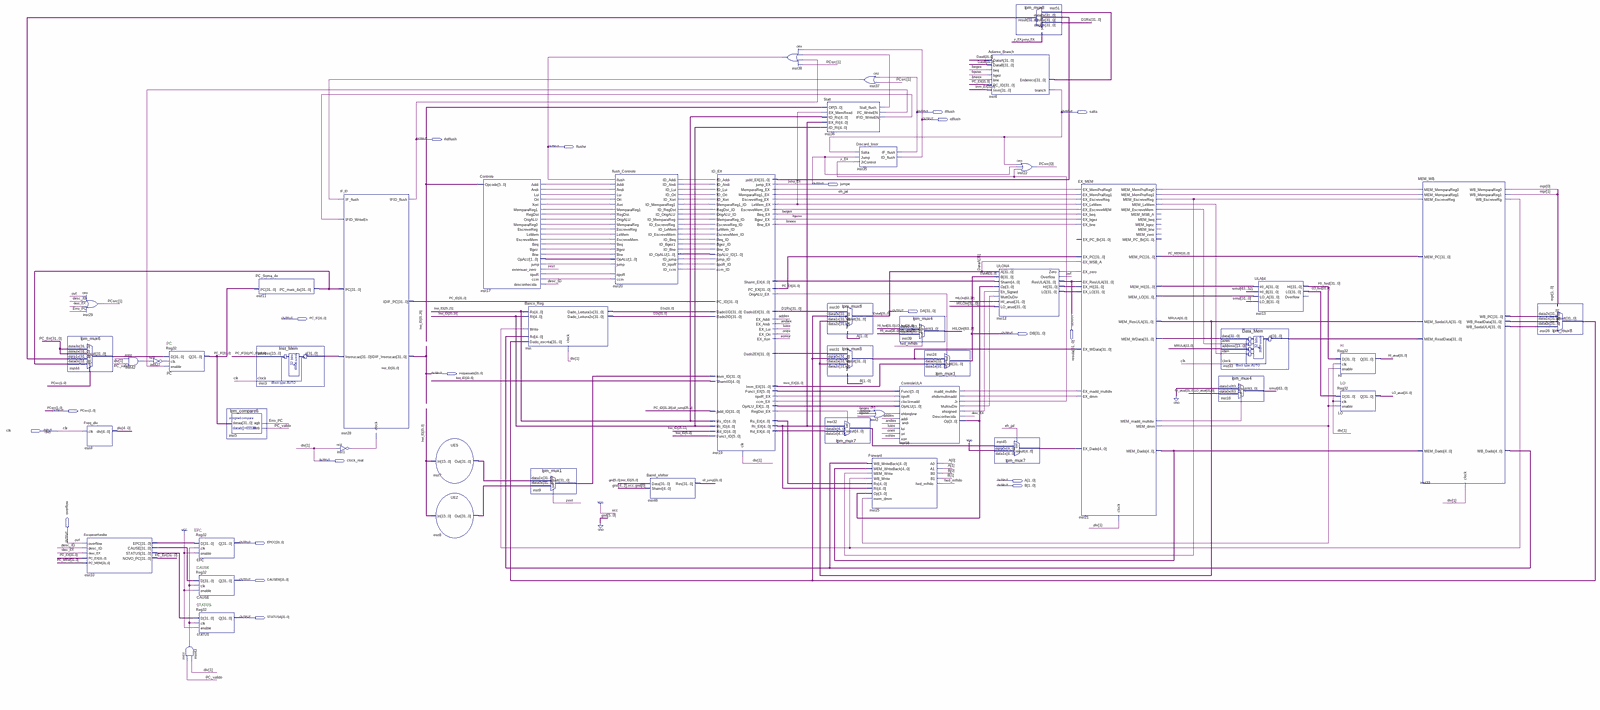
[diagram p0: schematic sheet, whole]
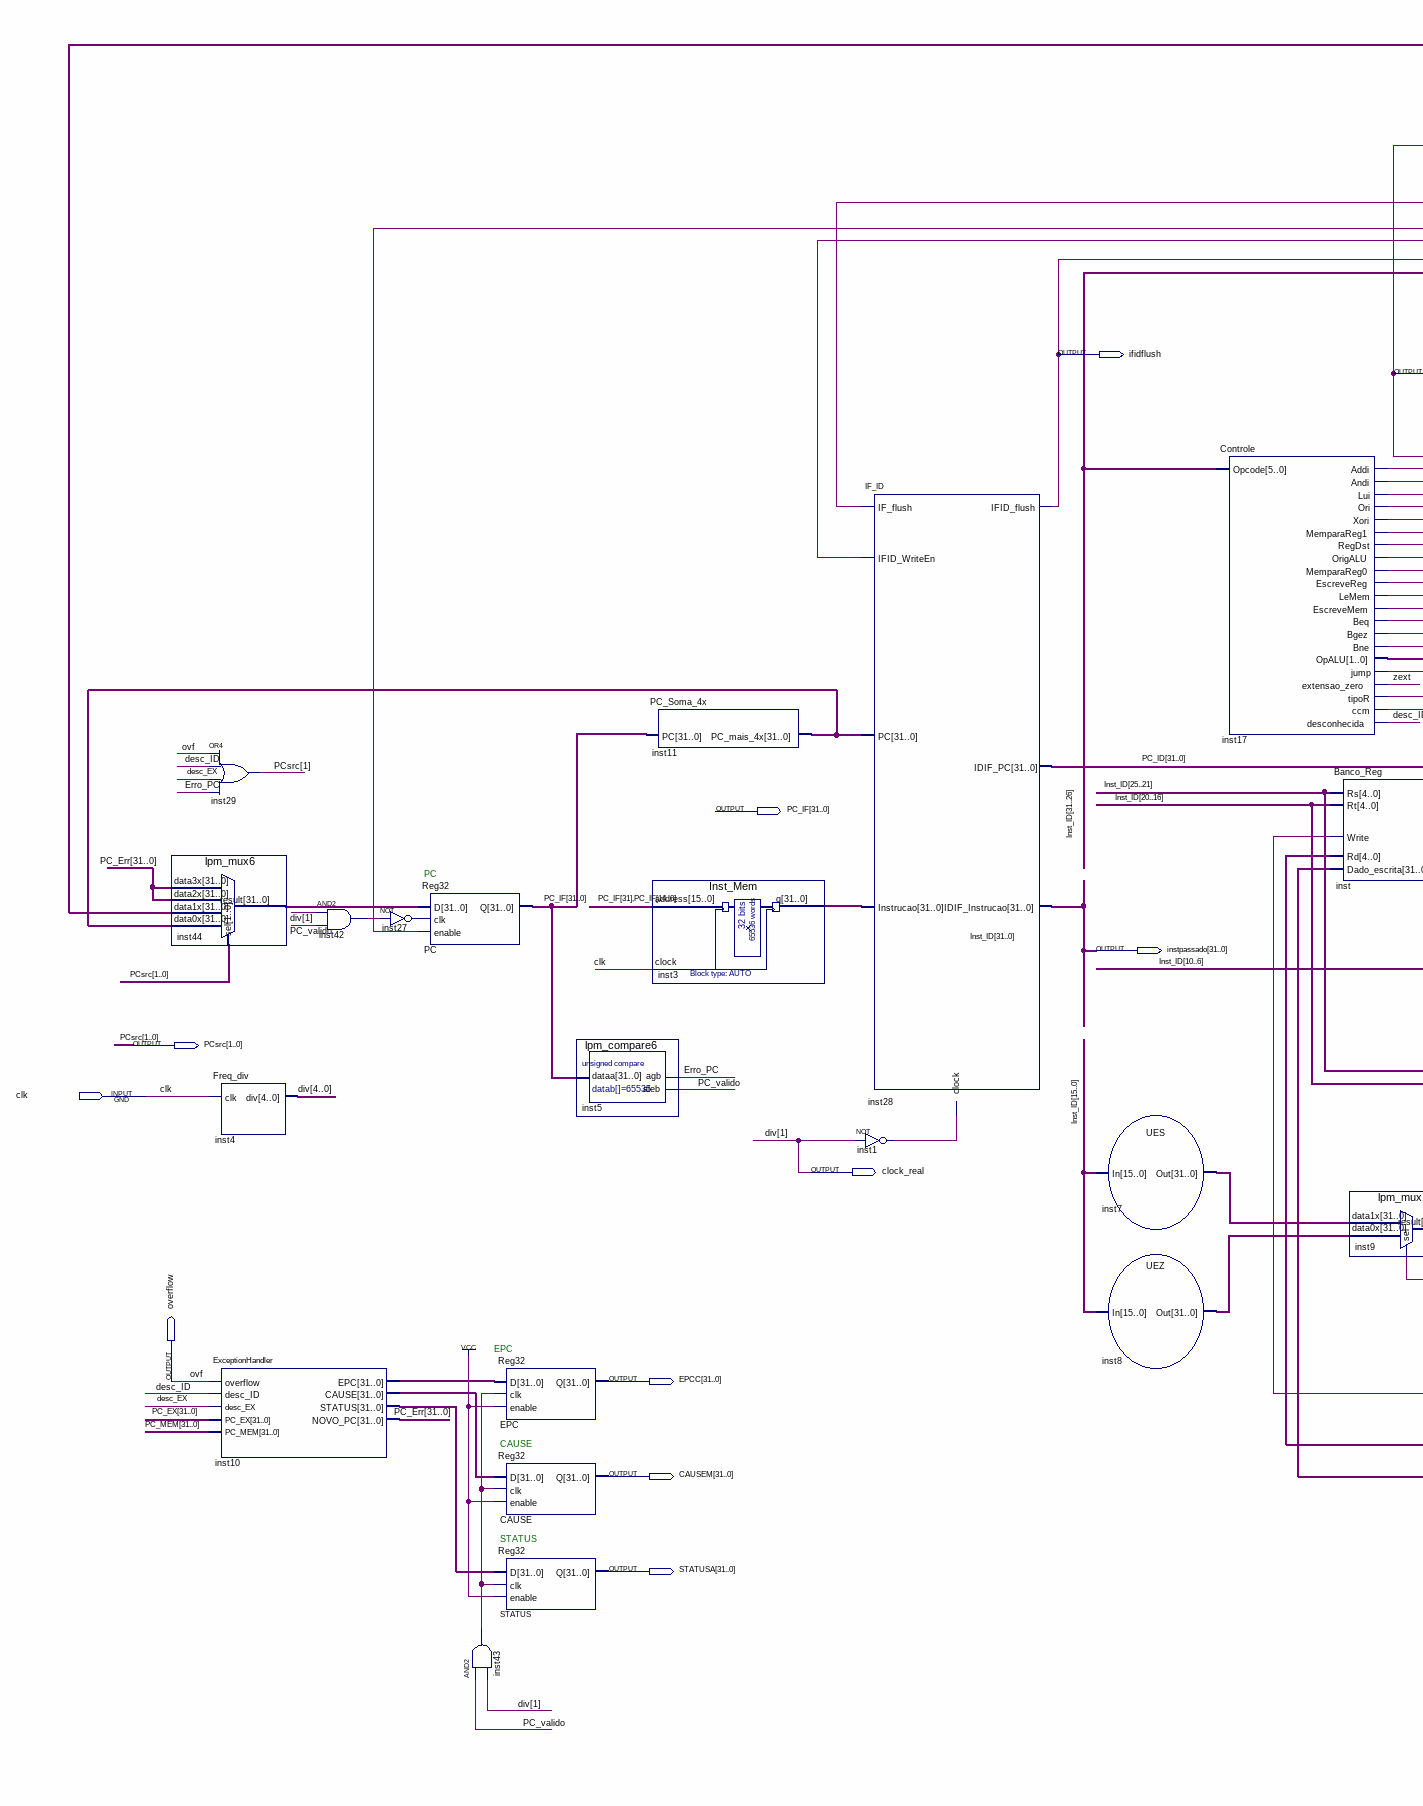
[diagram p1: schematic sheet, left part]
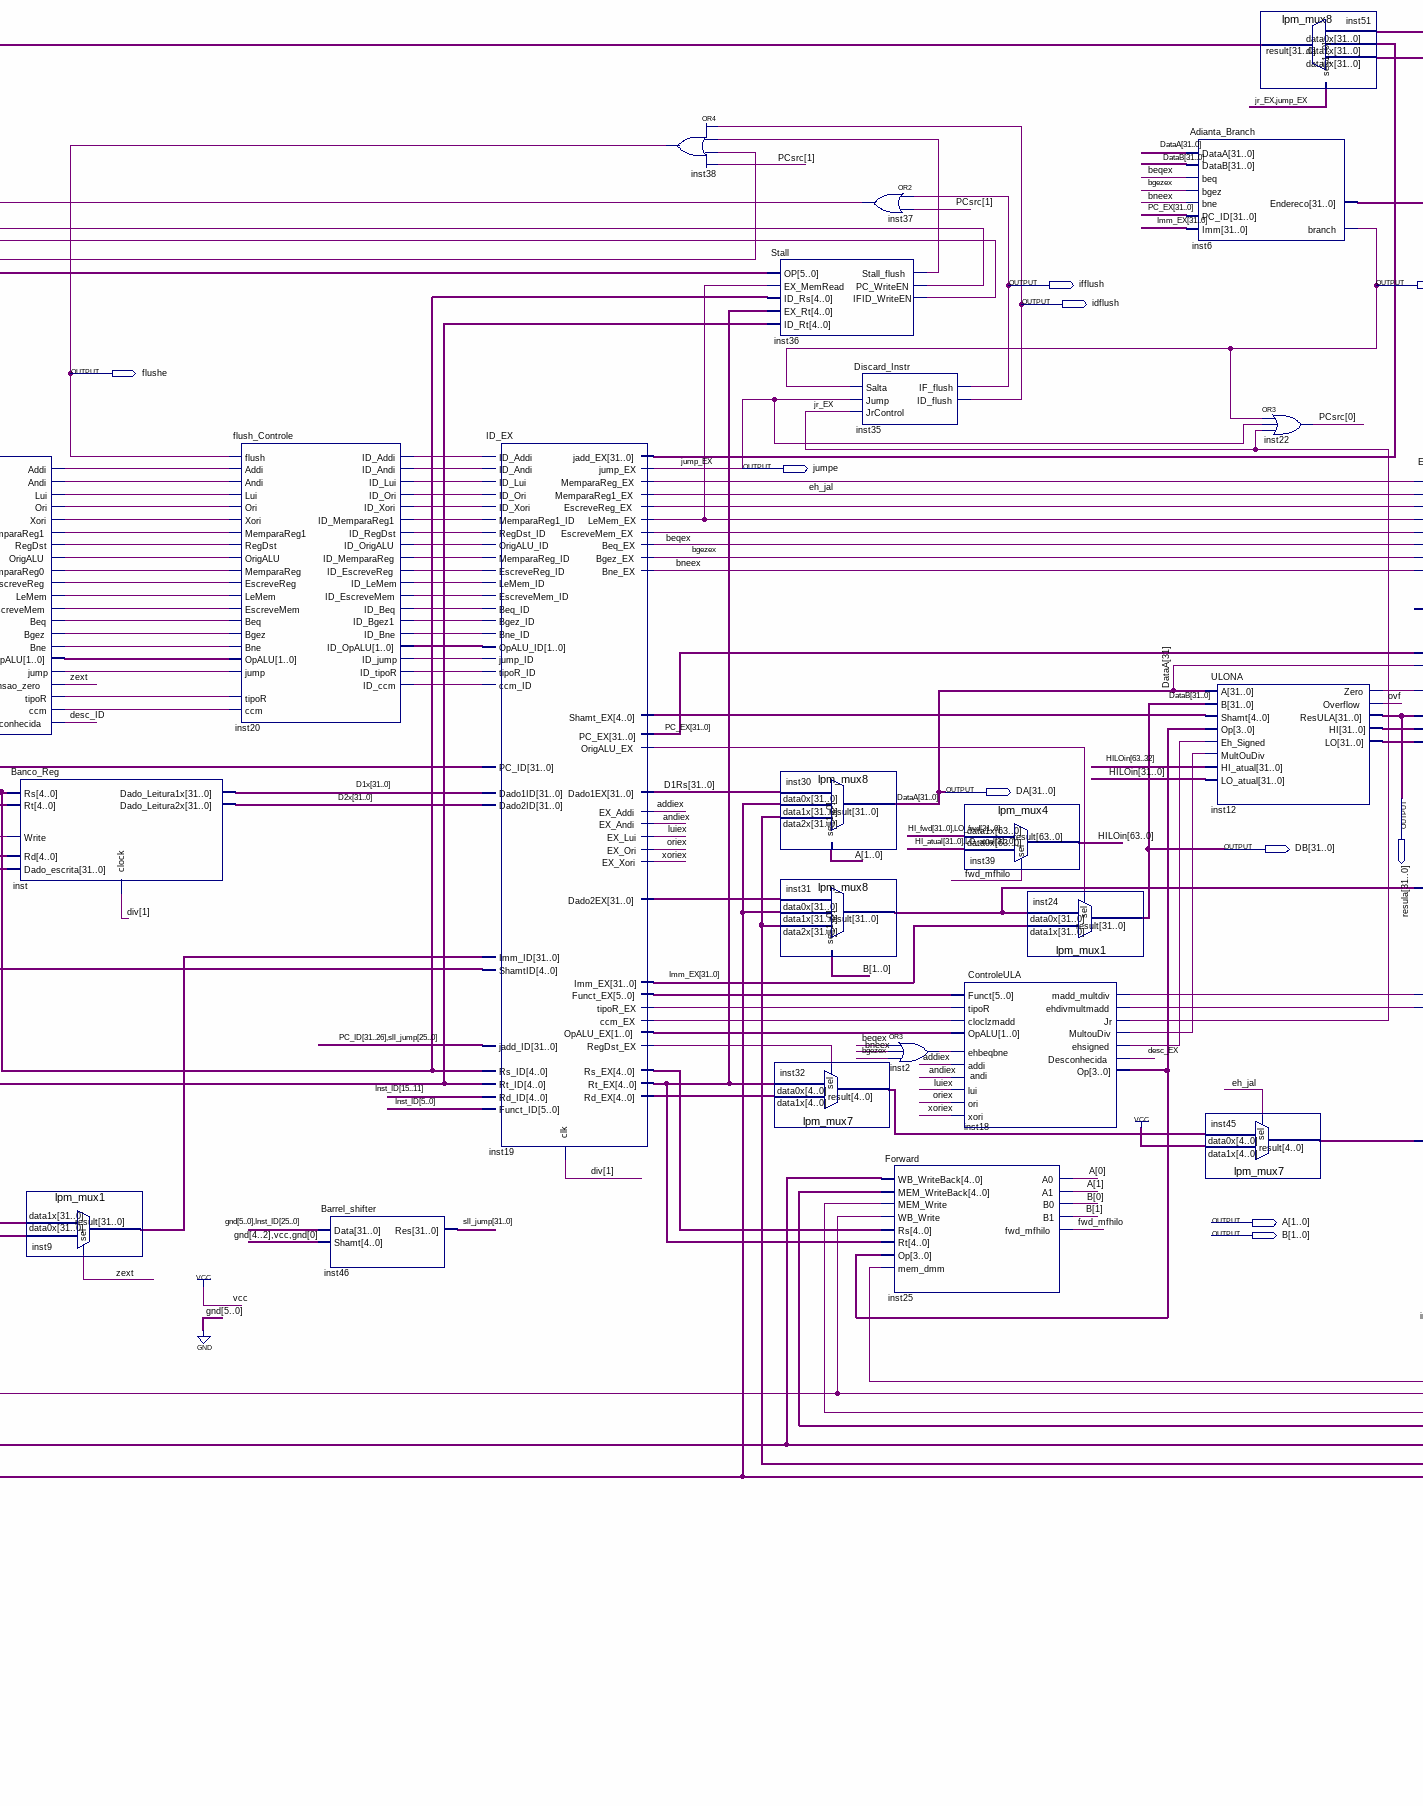
[diagram p2: schematic sheet, centre part]
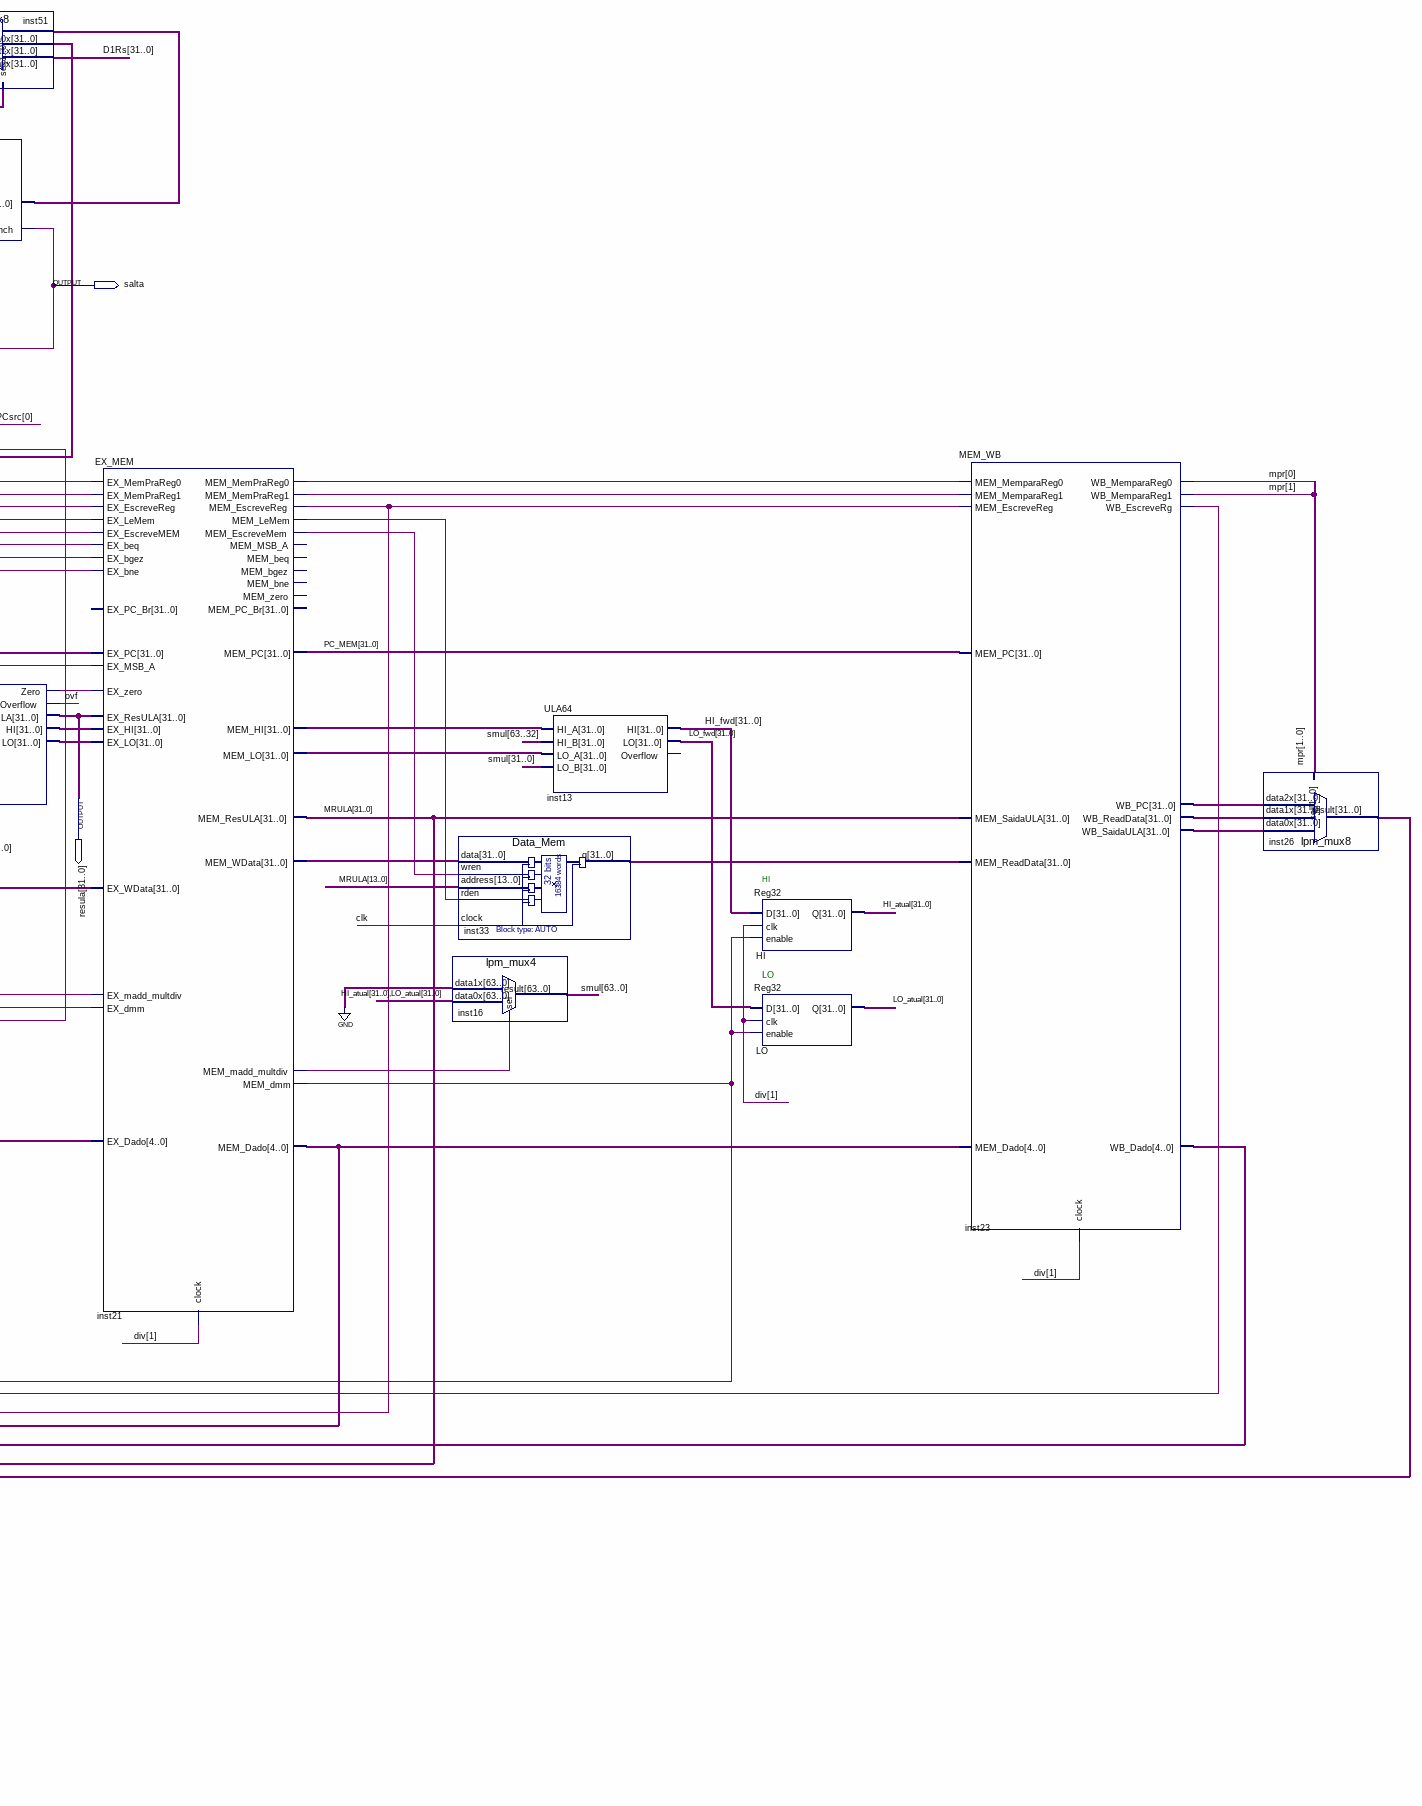
[diagram p3: schematic sheet, right part]
// Quartus schematic Pipeline.bdf as structural Verilog: 49 symbols, 20 pins
module Pipeline (
  input  clk,
  output ifflush,
  output salta,
  output idflush,
  output ifidflush,
  output flushe,
  output jumpe,
  output [31:0] DA,
  output [31:0] resula,
  output [31:0] PC_IF,
  output [31:0] DB,
  output [31:0] instpassado,
  output [1:0] PCsrc,
  output clock_real,
  output [1:0] A,
  output [1:0] B,
  output overflow,
  output [31:0] EPCC,
  output [31:0] CAUSEM,
  output [31:0] STATUSA
);

  wire addiex, andiex, beqex, bgezex, bneex, desc_EX, desc_ID, eh_jal, Erro_PC, fwd_mfhilo, inst1_out,
       inst2_out, inst12_zero, inst17_addi, inst17_andi, inst17_beq, inst17_bgez, inst17_bne, inst17_ccm,
       inst17_escrevemem, inst17_escrevereg, inst17_jump, inst17_lemem, inst17_lui, inst17_memparareg0,
       inst17_memparareg1, inst17_ori, inst17_origalu, inst17_regdst, inst17_tipor, inst17_xori,
       inst18_ehdivmultmadd, inst18_ehsigned, inst18_madd_multdiv, inst18_multoudiv, inst19_ccm_ex,
       inst19_escrevemem_ex, inst19_escrevereg_ex, inst19_lemem_ex, inst19_memparareg_ex, inst19_origalu_ex,
       inst19_regdst_ex, inst19_tipor_ex, inst20_id_addi, inst20_id_andi, inst20_id_beq, inst20_id_bgez1,
       inst20_id_bne, inst20_id_ccm, inst20_id_escrevemem, inst20_id_escrevereg, inst20_id_jump,
       inst20_id_lemem, inst20_id_lui, inst20_id_memparareg, inst20_id_memparareg1, inst20_id_ori,
       inst20_id_origalu, inst20_id_regdst, inst20_id_tipor, inst20_id_xori, inst21_mem_dmm,
       inst21_mem_escrevemem, inst21_mem_escrevereg, inst21_mem_lemem, inst21_mem_madd_multdiv,
       inst21_mem_memprareg0, inst21_mem_memprareg1, inst23_wb_escreverg, inst27_out, inst36_ifid_writeen,
       inst36_pc_writeen, inst36_stall_flush, inst37_out, inst42_out, inst43_out, jr_EX, luiex, oriex,
       PC_valido, xoriex, zext;
  wire [1:0] inst17_opalu, inst19_opalu_ex, inst20_id_opalu, mpr;
  wire [3:0] inst18_op;
  wire [4:0] div, inst19_rd_ex, inst19_rs_ex, inst19_rt_ex, inst19_shamt_ex, inst21_mem_dado, inst23_wb_dado,
       inst32_result, inst45_result;
  wire [5:0] inst19_funct_ex;
  wire [31:0] D1Rs, D1x, D2x, HI_atual, HI_fwd, Imm_EX, inst3_q, inst6_endereco, inst7_out, inst8_out,
       inst9_result, inst10_cause, inst10_epc, inst10_status, inst11_pc_mais_4x, inst12_hi, inst12_lo,
       inst19_dado2ex, inst19_jadd_ex, inst21_mem_hi, inst21_mem_lo, inst21_mem_wdata, inst23_wb_pc,
       inst23_wb_readdata, inst23_wb_saidaula, inst26_result, inst31_result, inst33_q, inst44_result,
       inst51_result, LO_atual, LO_fwd, MRULA, PC_Err, PC_EX, PC_ID, PC_MEM, sll_jump;
  wire [63:0] HILOin, smul;

  lpm_mux6 inst44 (
    .data3x(PC_Err), .data2x(PC_Err), .data1x(inst51_result), .data0x(inst11_pc_mais_4x), .sel(PCsrc),
    .result(inst44_result));
  or inst29 (PCsrc[1], overflow, desc_ID, desc_EX, Erro_PC);
  Freq_div inst4 (.clk(clk), .div({div[4:2], clock_real, div[0]}));
  ExceptionHandler inst10 (
    .overflow(overflow), .desc_ID(desc_ID), .desc_EX(desc_EX), .PC_EX(PC_EX), .PC_MEM(PC_MEM),
    .EPC(inst10_epc), .CAUSE(inst10_cause), .STATUS(inst10_status), .NOVO_PC(PC_Err));
  and inst42 (inst42_out, clock_real, PC_valido);
  not inst27 (inst27_out, inst42_out);
  Reg32 PC (.D(inst44_result), .clk(inst27_out), .enable(inst36_pc_writeen), .Q(PC_IF));
  and inst43 (inst43_out, PC_valido, clock_real);
  Reg32 EPC (.D(inst10_epc), .clk(inst43_out), .enable(1'b1), .Q(EPCC));
  Reg32 CAUSE (.D(inst10_cause), .clk(inst43_out), .enable(1'b1), .Q(CAUSEM));
  Reg32 STATUS (.D(inst10_status), .clk(inst43_out), .enable(1'b1), .Q(STATUSA));
  lpm_compare6 inst5 (.dataa(PC_IF), .agb(Erro_PC), .aleb(PC_valido));
  PC_Soma_4x inst11 (.PC(PC_IF), .PC_mais_4x(inst11_pc_mais_4x));
  Inst_Mem inst3 (.address({PC_IF[31], PC_IF[14:0]}), .clock(clk), .q(inst3_q));
  IF_ID inst28 (
    .IF_flush(inst37_out), .PC(inst11_pc_mais_4x), .clock(inst1_out), .Instrucao(inst3_q),
    .IFID_WriteEn(inst36_ifid_writeen), .IFID_flush(ifidflush), .IDIF_PC(PC_ID), .IDIF_Instrucao(instpassado));
  not inst1 (inst1_out, clock_real);
  UES inst7 (.In(instpassado[15:0]), .Out(inst7_out));
  UEZ inst8 (.In(instpassado[15:0]), .Out(inst8_out));
  Controle inst17 (
    .Opcode(instpassado[31:26]), .Addi(inst17_addi), .Andi(inst17_andi), .Lui(inst17_lui), .Ori(inst17_ori),
    .Xori(inst17_xori), .MemparaReg1(inst17_memparareg1), .RegDst(inst17_regdst), .OrigALU(inst17_origalu),
    .MemparaReg0(inst17_memparareg0), .EscreveReg(inst17_escrevereg), .LeMem(inst17_lemem),
    .EscreveMem(inst17_escrevemem), .Beq(inst17_beq), .Bgez(inst17_bgez), .Bne(inst17_bne),
    .OpALU(inst17_opalu), .jump(inst17_jump), .extensao_zero(zext), .tipoR(inst17_tipor), .ccm(inst17_ccm),
    .desconhecida(desc_ID));
  Banco_Reg inst (
    .Rs(instpassado[25:21]), .Rt(instpassado[20:16]), .Dado_escrita(inst26_result), .clock(clock_real),
    .Write(inst23_wb_escreverg), .Rd(inst23_wb_dado), .Dado_Leitura1x(D1x), .Dado_Leitura2x(D2x));
  lpm_mux1 inst9 (.data1x(inst7_out), .data0x(inst8_out), .sel(zext), .result(inst9_result));
  flush_Controle inst20 (
    .flush(flushe), .Addi(inst17_addi), .Andi(inst17_andi), .Lui(inst17_lui), .Ori(inst17_ori),
    .Xori(inst17_xori), .MemparaReg1(inst17_memparareg1), .RegDst(inst17_regdst), .OrigALU(inst17_origalu),
    .MemparaReg(inst17_memparareg0), .EscreveReg(inst17_escrevereg), .LeMem(inst17_lemem),
    .EscreveMem(inst17_escrevemem), .Beq(inst17_beq), .Bgez(inst17_bgez), .Bne(inst17_bne),
    .OpALU(inst17_opalu), .jump(inst17_jump), .tipoR(inst17_tipor), .ccm(inst17_ccm),
    .ID_Addi(inst20_id_addi), .ID_Andi(inst20_id_andi), .ID_Lui(inst20_id_lui), .ID_Ori(inst20_id_ori),
    .ID_Xori(inst20_id_xori), .ID_MemparaReg1(inst20_id_memparareg1), .ID_RegDst(inst20_id_regdst),
    .ID_OrigALU(inst20_id_origalu), .ID_MemparaReg(inst20_id_memparareg),
    .ID_EscreveReg(inst20_id_escrevereg), .ID_LeMem(inst20_id_lemem), .ID_EscreveMem(inst20_id_escrevemem),
    .ID_Beq(inst20_id_beq), .ID_Bgez1(inst20_id_bgez1), .ID_Bne(inst20_id_bne), .ID_OpALU(inst20_id_opalu),
    .ID_jump(inst20_id_jump), .ID_tipoR(inst20_id_tipor), .ID_ccm(inst20_id_ccm));
  Barrel_shifter inst46 (.Data({{6{1'b0}}, instpassado[25:0]}), .Shamt(5'b00010), .Res(sll_jump));
  ID_EX inst19 (
    .ID_Addi(inst20_id_addi), .ID_Andi(inst20_id_andi), .ID_Lui(inst20_id_lui), .ID_Ori(inst20_id_ori),
    .ID_Xori(inst20_id_xori), .MemparaReg1_ID(inst20_id_memparareg1), .RegDst_ID(inst20_id_regdst),
    .OrigALU_ID(inst20_id_origalu), .MemparaReg_ID(inst20_id_memparareg),
    .EscreveReg_ID(inst20_id_escrevereg), .LeMem_ID(inst20_id_lemem), .EscreveMem_ID(inst20_id_escrevemem),
    .Beq_ID(inst20_id_beq), .Bgez_ID(inst20_id_bgez1), .Bne_ID(inst20_id_bne), .OpALU_ID(inst20_id_opalu),
    .jump_ID(inst20_id_jump), .PC_ID(PC_ID), .Dado1ID(D1x), .Dado2ID(D2x), .Imm_ID(inst9_result),
    .ShamtID(instpassado[10:6]), .Rs_ID(instpassado[25:21]), .Rt_ID(instpassado[20:16]),
    .Rd_ID(instpassado[15:11]), .tipoR_ID(inst20_id_tipor), .ccm_ID(inst20_id_ccm),
    .Funct_ID(instpassado[5:0]), .jadd_ID({PC_ID[31:26], sll_jump[25:0]}), .clk(clock_real),
    .EX_Addi(addiex), .EX_Andi(andiex), .EX_Lui(luiex), .EX_Ori(oriex), .EX_Xori(xoriex),
    .MemparaReg1_EX(eh_jal), .RegDst_EX(inst19_regdst_ex), .OrigALU_EX(inst19_origalu_ex),
    .MemparaReg_EX(inst19_memparareg_ex), .EscreveReg_EX(inst19_escrevereg_ex), .LeMem_EX(inst19_lemem_ex),
    .EscreveMem_EX(inst19_escrevemem_ex), .Beq_EX(beqex), .Bgez_EX(bgezex), .Bne_EX(bneex),
    .OpALU_EX(inst19_opalu_ex), .jump_EX(jumpe), .PC_EX(PC_EX), .Dado1EX(D1Rs), .Dado2EX(inst19_dado2ex),
    .Imm_EX(Imm_EX), .Shamt_EX(inst19_shamt_ex), .Rs_EX(inst19_rs_ex), .Rt_EX(inst19_rt_ex),
    .Rd_EX(inst19_rd_ex), .tipoR_EX(inst19_tipor_ex), .ccm_EX(inst19_ccm_ex), .Funct_EX(inst19_funct_ex),
    .jadd_EX(inst19_jadd_ex));
  or inst38 (flushe, idflush, inst36_stall_flush, ifidflush, PCsrc[1]);
  Stall inst36 (
    .OP(instpassado[31:26]), .EX_MemRead(inst19_lemem_ex), .ID_Rs(instpassado[25:21]), .EX_Rt(inst19_rt_ex),
    .ID_Rt(instpassado[20:16]), .IFID_WriteEN(inst36_ifid_writeen), .Stall_flush(inst36_stall_flush),
    .PC_WriteEN(inst36_pc_writeen));
  lpm_mux8 inst30 (.data2x(MRULA), .data1x(inst26_result), .data0x(D1Rs), .sel(A), .result(DA));
  lpm_mux8 inst31 (.data2x(MRULA), .data1x(inst26_result), .data0x(inst19_dado2ex), .sel(B), .result(inst31_result));
  lpm_mux7 inst32 (.data1x(inst19_rd_ex), .data0x(inst19_rt_ex), .sel(inst19_regdst_ex), .result(inst32_result));
  or inst37 (inst37_out, ifflush, PCsrc[1]);
  Discard_Instr inst35 (.Salta(salta), .Jump(jumpe), .JrControl(jr_EX), .IF_flush(ifflush), .ID_flush(idflush));
  Forward inst25 (
    .WB_WriteBack(inst23_wb_dado), .MEM_WriteBack(inst21_mem_dado), .MEM_Write(inst21_mem_escrevereg),
    .WB_Write(inst23_wb_escreverg), .mem_dmm(inst21_mem_dmm), .Rs(inst19_rs_ex), .Rt(inst19_rt_ex),
    .Op(inst18_op), .A0(A[0]), .A1(A[1]), .B0(B[0]), .B1(B[1]), .fwd_mfhilo(fwd_mfhilo));
  or inst2 (inst2_out, beqex, bneex, bgezex);
  lpm_mux4 inst39 (.data1x({HI_fwd, LO_fwd}), .data0x({HI_atual, LO_atual}), .sel(fwd_mfhilo), .result(HILOin));
  ControleULA inst18 (
    .addi(addiex), .andi(andiex), .lui(luiex), .ori(oriex), .xori(xoriex), .Funct(inst19_funct_ex),
    .tipoR(inst19_tipor_ex), .cloclzmadd(inst19_ccm_ex), .OpALU(inst19_opalu_ex), .ehbeqbne(inst2_out),
    .madd_multdiv(inst18_madd_multdiv), .ehdivmultmadd(inst18_ehdivmultmadd), .Jr(jr_EX),
    .MultouDiv(inst18_multoudiv), .ehsigned(inst18_ehsigned), .Desconhecida(desc_EX), .Op(inst18_op));
  lpm_mux1 inst24 (.data1x(Imm_EX), .data0x(inst31_result), .sel(inst19_origalu_ex), .result(DB));
  Adianta_Branch inst6 (
    .DataA(DA), .DataB(DB), .beq(beqex), .bgez(bgezex), .bne(bneex), .PC_ID(PC_EX), .Imm(Imm_EX),
    .branch(salta), .Endereco(inst6_endereco));
  ULONA inst12 (
    .A(DA), .B(DB), .Shamt(inst19_shamt_ex), .Op(inst18_op), .Eh_Signed(inst18_ehsigned),
    .LO_atual(HILOin[31:0]), .HI_atual(HILOin[63:32]), .MultOuDiv(inst18_multoudiv), .Zero(inst12_zero),
    .Overflow(overflow), .ResULA(resula), .HI(inst12_hi), .LO(inst12_lo));
  lpm_mux7 inst45 (.data1x({5{1'b1}}), .data0x(inst32_result), .sel(eh_jal), .result(inst45_result));
  lpm_mux8 inst51 (
    .data2x(D1Rs), .data1x(inst19_jadd_ex), .data0x(inst6_endereco), .sel({jr_EX, jumpe}),
    .result(inst51_result));
  or inst22 (PCsrc[0], salta, jumpe, jr_EX);
  EX_MEM inst21 (
    .clock(clock_real), .EX_MemPraReg0(inst19_memparareg_ex), .EX_MemPraReg1(eh_jal),
    .EX_EscreveReg(inst19_escrevereg_ex), .EX_LeMem(inst19_lemem_ex), .EX_EscreveMEM(inst19_escrevemem_ex),
    .EX_zero(inst12_zero), .EX_ResULA(resula), .EX_Dado(inst45_result), .EX_HI(inst12_hi), .EX_LO(inst12_lo),
    .EX_WData(inst31_result), .EX_MSB_A(DA[31]), .EX_madd_multdiv(inst18_madd_multdiv),
    .EX_dmm(inst18_ehdivmultmadd), .EX_beq(beqex), .EX_bne(bneex), .EX_bgez(bgezex), .EX_PC(PC_EX),
    .MEM_MemPraReg0(inst21_mem_memprareg0), .MEM_MemPraReg1(inst21_mem_memprareg1),
    .MEM_EscreveReg(inst21_mem_escrevereg), .MEM_LeMem(inst21_mem_lemem),
    .MEM_EscreveMem(inst21_mem_escrevemem), .MEM_ResULA(MRULA), .MEM_Dado(inst21_mem_dado),
    .MEM_HI(inst21_mem_hi), .MEM_LO(inst21_mem_lo), .MEM_WData(inst21_mem_wdata),
    .MEM_madd_multdiv(inst21_mem_madd_multdiv), .MEM_dmm(inst21_mem_dmm), .MEM_PC(PC_MEM));  // open: EX_PC_Br, MEM_zero, MEM_PC_Br, MEM_MSB_A, MEM_beq, MEM_bne, MEM_bgez
  Data_Mem inst33 (
    .data(inst21_mem_wdata), .wren(inst21_mem_escrevemem), .address(MRULA[13:0]), .rden(inst21_mem_lemem),
    .clock(clk), .q(inst33_q));
  lpm_mux4 inst16 (.data1x({64{1'b0}}), .data0x({HI_atual, LO_atual}), .sel(inst21_mem_madd_multdiv), .result(smul));
  ULA64 inst13 (
    .HI_A(inst21_mem_hi), .HI_B(smul[63:32]), .LO_A(inst21_mem_lo), .LO_B(smul[31:0]), .LO(LO_fwd),
    .HI(HI_fwd));  // open: Overflow
  Reg32 HI (.D(HI_fwd), .clk(clock_real), .enable(inst21_mem_dmm), .Q(HI_atual));
  Reg32 LO (.D(LO_fwd), .clk(clock_real), .enable(inst21_mem_dmm), .Q(LO_atual));
  MEM_WB inst23 (
    .MEM_EscreveReg(inst21_mem_escrevereg), .MEM_MemparaReg0(inst21_mem_memprareg0),
    .MEM_MemparaReg1(inst21_mem_memprareg1), .MEM_PC(PC_MEM), .MEM_ReadData(inst33_q), .MEM_SaidaULA(MRULA),
    .MEM_Dado(inst21_mem_dado), .clock(clock_real), .WB_EscreveRg(inst23_wb_escreverg),
    .WB_MemparaReg0(mpr[0]), .WB_MemparaReg1(mpr[1]), .WB_PC(inst23_wb_pc), .WB_ReadData(inst23_wb_readdata),
    .WB_SaidaULA(inst23_wb_saidaula), .WB_Dado(inst23_wb_dado));
  lpm_mux8 inst26 (
    .data2x(inst23_wb_pc), .data1x(inst23_wb_readdata), .data0x(inst23_wb_saidaula), .sel(mpr),
    .result(inst26_result));

  // Other names for the same wires on the sheet: DataA[31:0] = DA; DataB[31:0] = DB; div[1] = clock_real;
  //   Inst_ID[31:0] = instpassado; jump_EX = jumpe; ovf = overflow

  // Notes on the sheet:
  //   PC
  //   HI
  //   LO
  //   EPC
  //   CAUSE
  //   STATUS
endmodule
